# EAGLE design mc_psu_v2 (EAGLE 9.4.2)
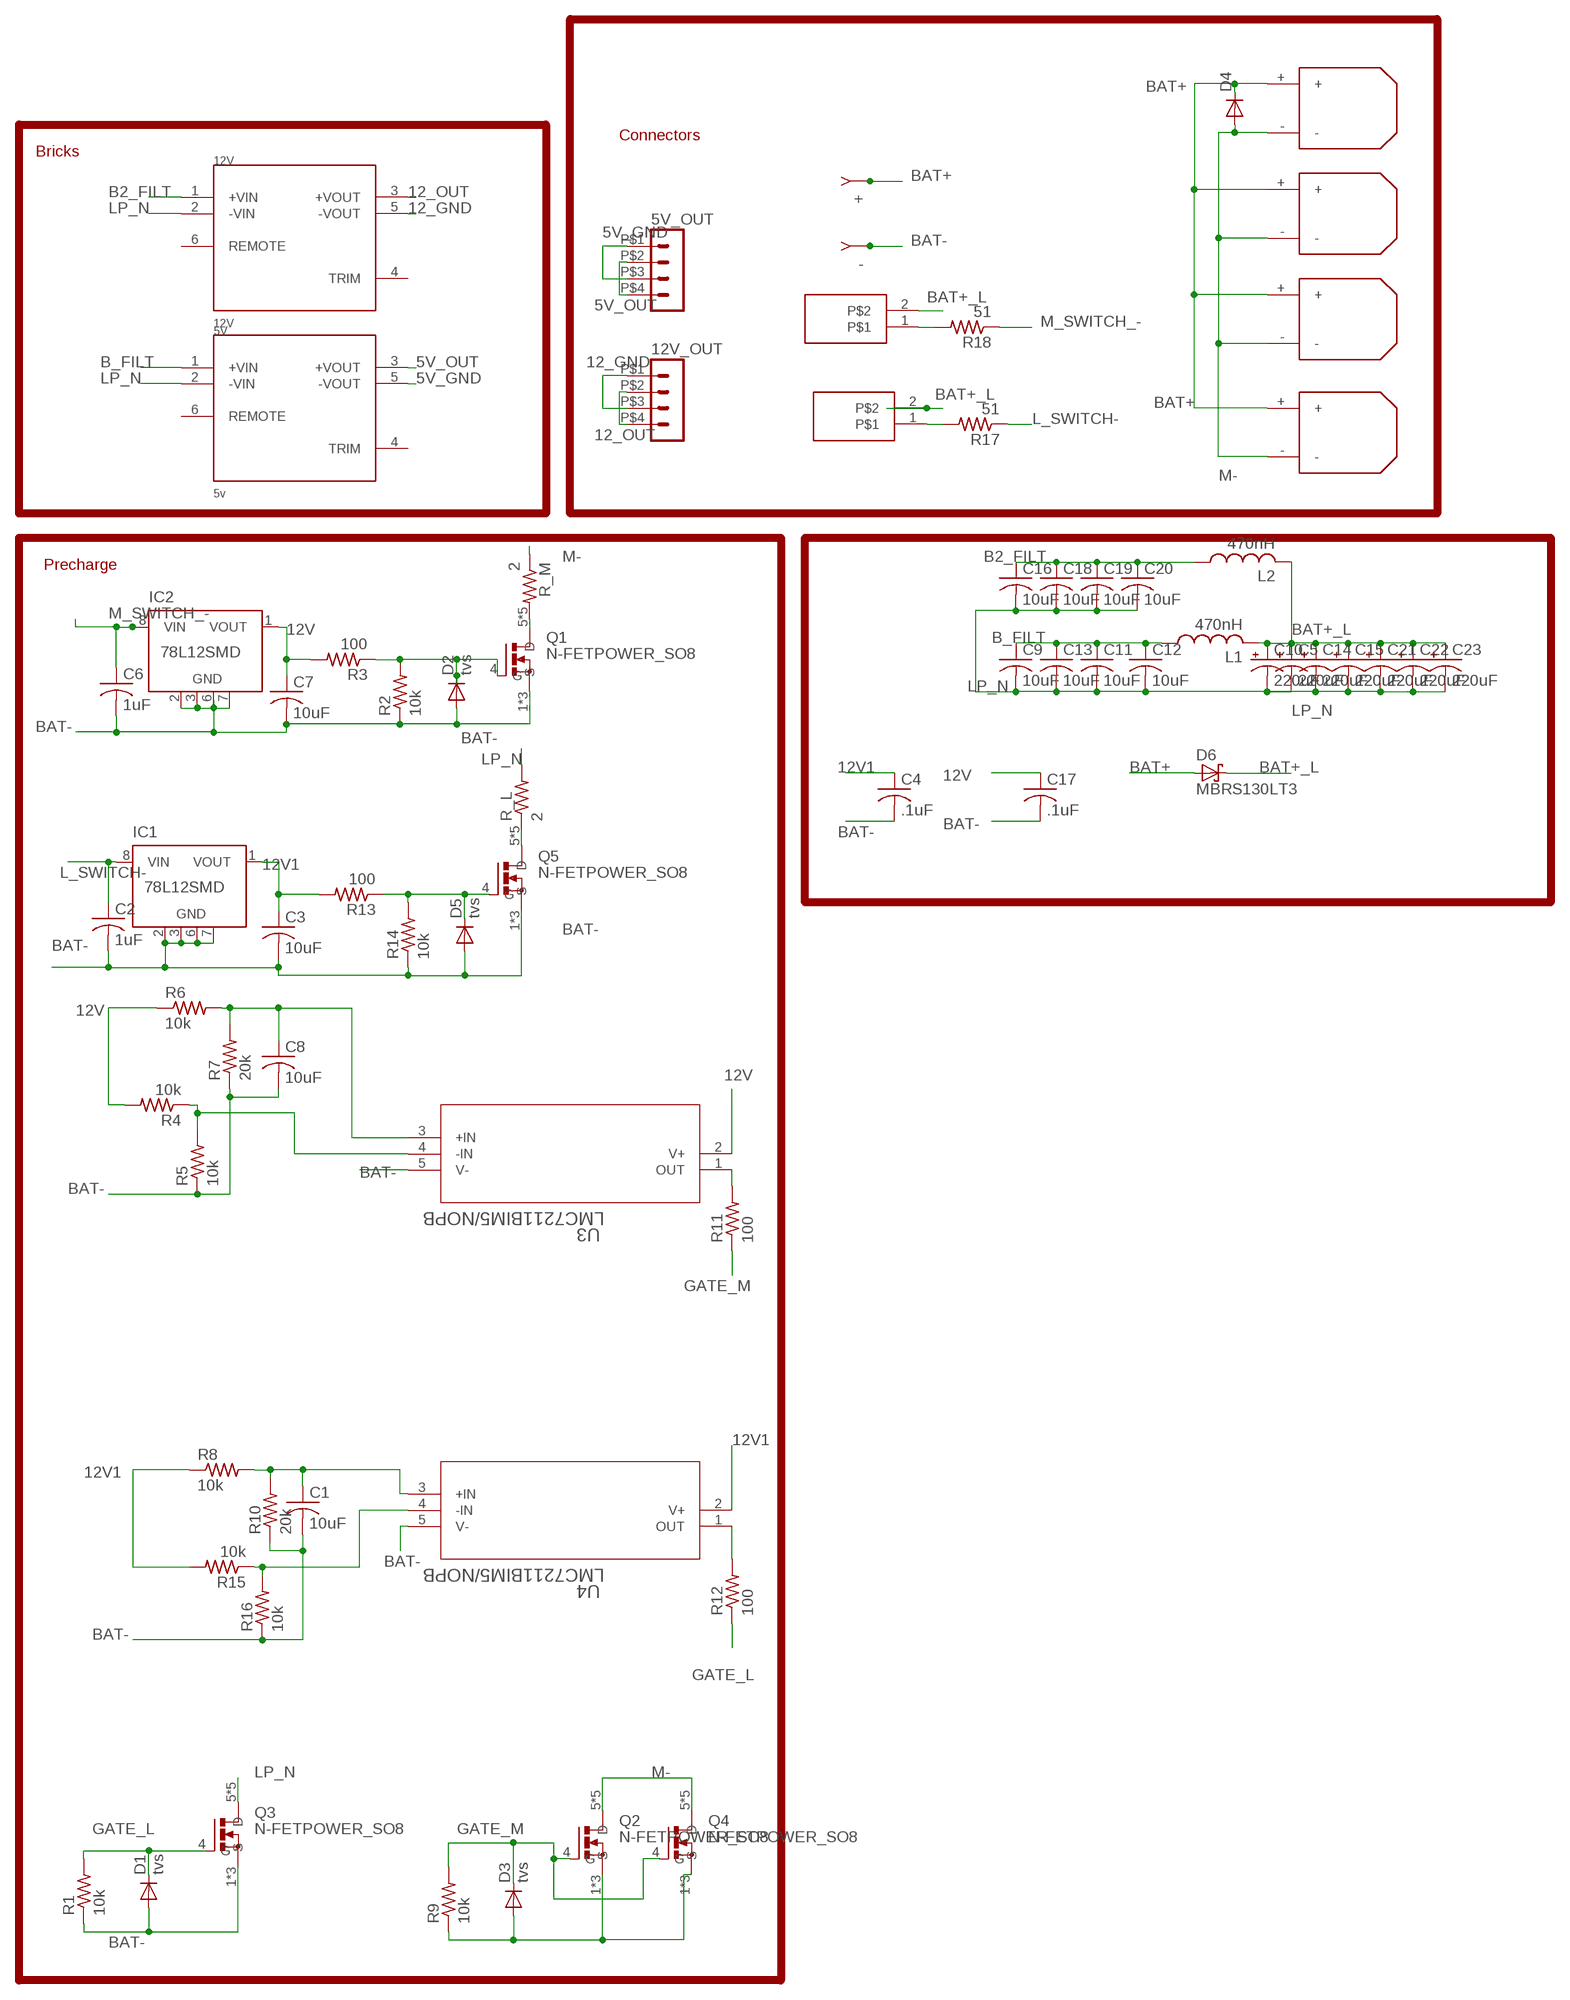
[diagram p0: schematic, sheet 1]

## Parts
5V  5v  PDQ30-Q24-S5-D  [CONV_PDQ30-Q24-S5-D]
5V_OUT  HEADER_POS4_43045-0401  [43045-0400]
12V  12V  PDQ30-Q24-S5-D  [CONV_PDQ30-Q24-S5-D]
12V_OUT  HEADER_POS4_43045-0401  [43045-0400]
+  QFIT  [FASTON]
-  QFIT  [FASTON]
C1  10uF  C-USC0603K  [C0603K]
C2  1uF  C-USC0603K  [C0603K]
C3  10uF  C-USC0603K  [C0603K]
C4  .1uF  C-USC0603K  [C0603K]
C5  220uF  CPOL-USE3.5-8  [E3,5-8]
C6  1uF  C-USC0603K  [C0603K]
C7  10uF  C-USC0603K  [C0603K]
C8  10uF  C-USC0603K  [C0603K]
C9  10uF  C-USC1206K  [C1206K]
C10  220uF  CPOL-USE3.5-8  [E3,5-8]
C11  10uF  C-USC1206K  [C1206K]
C12  10uF  C-USC1206K  [C1206K]
C13  10uF  C-USC1206K  [C1206K]
C14  220uF  CPOL-USE3.5-8  [E3,5-8]
C15  220uF  CPOL-USE3.5-8  [E3,5-8]
C16  10uF  C-USC1206K  [C1206K]
C17  .1uF  C-USC0603K  [C0603K]
C18  10uF  C-USC1206K  [C1206K]
C19  10uF  C-USC1206K  [C1206K]
C20  10uF  C-USC1206K  [C1206K]
C21  220uF  CPOL-USE3.5-8  [E3,5-8]
C22  220uF  CPOL-USE3.5-8  [E3,5-8]
C23  220uF  CPOL-USE3.5-8  [E3,5-8]
D1  tvs  DIODE-DO214AC  [DO214AC]
D2  tvs  DIODE-DO214AC  [DO214AC]
D3  tvs  DIODE-DO214AC  [DO214AC]
D4  DIODE-SMB  [SMB]
D5  tvs  DIODE-DO214AC  [DO214AC]
D6  MBRS130LT3  [SMB]
IC1  78L12SMD  [SO08]
IC2  78L12SMD  [SO08]
L1  470nH  L-USL3225P  [L3225P]
L2  470nH  L-USL3225P  [L3225P]
Q1  N-FETPOWER_SO8  [TRANS_TPH5900CNH,L1Q]
Q2  N-FETPOWER_SO8  [TRANS_TPH5900CNH,L1Q]
Q3  N-FETPOWER_SO8  [TRANS_TPH5900CNH,L1Q]
Q4  N-FETPOWER_SO8  [TRANS_TPH5900CNH,L1Q]
Q5  N-FETPOWER_SO8  [TRANS_TPH5900CNH,L1Q]
R1  10k  R-US_R0402  [R0402]
R2  10k  R-US_R0402  [R0402]
R3  100  R-US_R0402  [R0402]
R4  10k  R-US_R0402  [R0402]
R5  10k  R-US_R0402  [R0402]
R6  10k  R-US_R0402  [R0402]
R7  20k  R-US_R0402  [R0402]
R8  10k  R-US_R0402  [R0402]
R9  10k  R-US_R0402  [R0402]
R10  20k  R-US_R0402  [R0402]
R11  100  R-US_R0402  [R0402]
R12  100  R-US_R0402  [R0402]
R13  100  R-US_R0402  [R0402]
R14  10k  R-US_R0402  [R0402]
R15  10k  R-US_R0402  [R0402]
R16  10k  R-US_R0402  [R0402]
R17  51  R-US_R0603  [R0603]
R18  51  R-US_R0603  [R0603]
R_L  2  RESISTOR  [D2PAK]
R_M  2  RESISTOR  [D2PAK]
U3  LMC7211BIM5/NOPB  [MF05A]
U4  LMC7211BIM5/NOPB  [MF05A]
U$3  XT30FEMALW  [XT30_H_F]
U$8  XT30FEMALW  [XT30_H_F]
U$9  XT30FEMALW  [XT30_H_F]
U$10  XT30FEMALW  [XT30_H_F]
U$13  2-PINM80_H  [M80-840242]
U$14  2-PINM80_H  [M80-840242]

## Nets
5V_GND: 5V.5(-VOUT) 5V_OUT.P$1 5V_OUT.P$3
5V_OUT: 5V.3(+VOUT) 5V_OUT.P$2 5V_OUT.P$4
12_GND: 12V.5(-VOUT) 12V_OUT.P$1 12V_OUT.P$3
12_OUT: 12V.3(+VOUT) 12V_OUT.P$2 12V_OUT.P$4
12V: C7.1 C17.1 IC2.1(VOUT) R3.2 R4.2 R6.1 U3.2(V+)
12V1: C3.1 C4.1 IC1.1(VOUT) R8.1 R13.2 R15.2 U4.2(V+)
B2_FILT: 12V.1(+VIN) C16.1 C18.1 C19.1 C20.1 L2.1
B_FILT: 5V.1(+VIN) C9.1 C11.1 C12.1 C13.1 L1.1
BAT+: +.1 +.2 D4.C D6.A U$3.+ U$8.+ U$9.+ U$10.+
BAT+_L: C5.+ C10.+ C14.+ C15.+ C21.+ C22.+ C23.+ D6.C L1.2 L2.2 U$13.2 U$14.2
BAT-: -.1 -.2 C1.2 C2.2 C3.2 C4.2 C6.2 C7.2 C8.2 C17.2 D1.A D2.A D3.A D5.A IC1.2(GND) IC1.3(GND) IC1.6(GND) IC1.7(GND) IC2.2(GND) IC2.3(GND) IC2.6(GND) IC2.7(GND) Q1.1(S) Q1.2(S) Q1.3(S) Q2.1(S) Q2.2(S) Q2.3(S) Q3.1(S) Q3.2(S) Q3.3(S) Q4.1(S) Q4.2(S) Q4.3(S) Q5.1(S) Q5.2(S) Q5.3(S) R1.1 R2.1 R5.1 R7.1 R9.1 R10.1 R14.1 R16.1 U3.5(V-) U4.5(V-)
GATE_L: D1.C Q3.4(G) R1.2 R12.1
GATE_M: D3.C Q2.4(G) Q4.4(G) R9.2 R11.1
L_SWITCH-: C2.1 IC1.8(VIN) R17.1
LP_N: 5V.2(-VIN) 12V.2(-VIN) C5.- C9.2 C10.- C11.2 C12.2 C13.2 C14.- C15.- C16.2 C18.2 C19.2 C20.2 C21.- C22.- C23.- Q3.5(D) Q3.6(D) Q3.7(D) Q3.8(D) Q3.EP(D) R_L.3
M-: D4.A Q2.5(D) Q2.6(D) Q2.7(D) Q2.8(D) Q2.EP(D) Q4.5(D) Q4.6(D) Q4.7(D) Q4.8(D) Q4.EP(D) R_M.1 U$3.- U$8.- U$9.- U$10.-
M_SWITCH_-: C6.1 IC2.8(VIN) R18.1
N$1: Q1.5(D) Q1.6(D) Q1.7(D) Q1.8(D) Q1.EP(D) R_M.3
N$2: D5.C Q5.4(G) R13.1 R14.2
N$3: D2.C Q1.4(G) R2.2 R3.1
N$4: R12.2 U4.1(OUT)
N$5: R18.2 U$13.1
N$6: C1.1 R8.2 R10.2 U4.3(+IN)
N$7: C8.1 R6.2 R7.2 U3.3(+IN)
N$8: R17.2 U$14.1
N$9: R11.2 U3.1(OUT)
N$10: R4.1 R5.2 U3.4(-IN)
N$13: Q5.5(D) Q5.6(D) Q5.7(D) Q5.8(D) Q5.EP(D) R_L.1
N$15: R15.1 R16.2 U4.4(-IN)
Unconnected: 5V.4(TRIM) 5V.6(REMOTE) 12V.4(TRIM) 12V.6(REMOTE) IC1.4(NC) IC1.5(NC) IC2.4(NC) IC2.5(NC)

## Notes on the sheet
- Connectors
- Bricks
- Precharge

## Library data of the parts
5V 12V = PDQ30-Q24-S5-D:PDQ30-Q24-S5-D: 12 Vdc, 2.5 A, 30 W, 9 ~ 36 Vdc; CUI_PURCHASE_URL: https://www.cui.com/product/power/dc-dc-converters/isolated/pdq30-d-series?utm_source=snapeda.com&utm_medium=referral&utm_campaign=snapedaBOM; DESCRIPTION: PDQ30-D Series 30 W 6 A 24 V Input 5 V Output Isolated DC-DC Converter; DIGI-KEY_PART_NUMBER: 102-3891-ND; DIGI-KEY_PURCHASE_URL: https://www.digikey.com/product-detail/en/cui-inc/PDQ30-Q24-S5-D/102-3891-ND/6165424?utm_source=snapeda&utm_medium=aggregator&utm_campaign=symbol; MF: CUI; MP: PDQ30-Q24-S5-D; PACKAGE: DIP-6 CUI
5V_OUT 12V_OUT = con-molex-micro-fit-3_0:HEADER_POS4_?: Molex - Micro-Fit 3.0 Series connector, 3.00mm (0.118") pitch header, 4 positions.
+ - = keystone:QFIT: QUICKFIT PCB TERMINAL
C1-C4 C6-C9 C11-C13 C16-C20 = rcl:C-US: CAPACITOR, American symbol
C5 C10 C14 C15 C21-C23 = rcl:CPOL-US: POLARIZED CAPACITOR, American symbol
D1-D5 = diode:DIODE-: DIODE
D6 = diode:MBRS130LT3: Schottky Power Rectifier Source: http://www.onsemi.com/pub/Collateral/MBRS130LT3-D.PDF
IC1 IC2 = linear:78L*SMD: Positive VOLTAGE REGULATOR
L1 L2 = rcl:L-US: INDUCTOR, American symbol
Q1-Q5 = Ben_Library:N-FET: N-CHANNEL MOS FET SYMBOL
R1-R18 = rcl:R-US_: RESISTOR, American symbol
R_L R_M = BenLibrary:RESISTOR
U3 U4 = lmc7211:LMC7211BIM5/NOPB; MANUFACTURER_PART_NUMBER: LMC7211BIM5NOPB; VENDOR: Texas Instruments
U$3 U$8-U$10 = Ben_Library:XT30
U$13 U$14 = Ben_Library:2-PIN

## Board
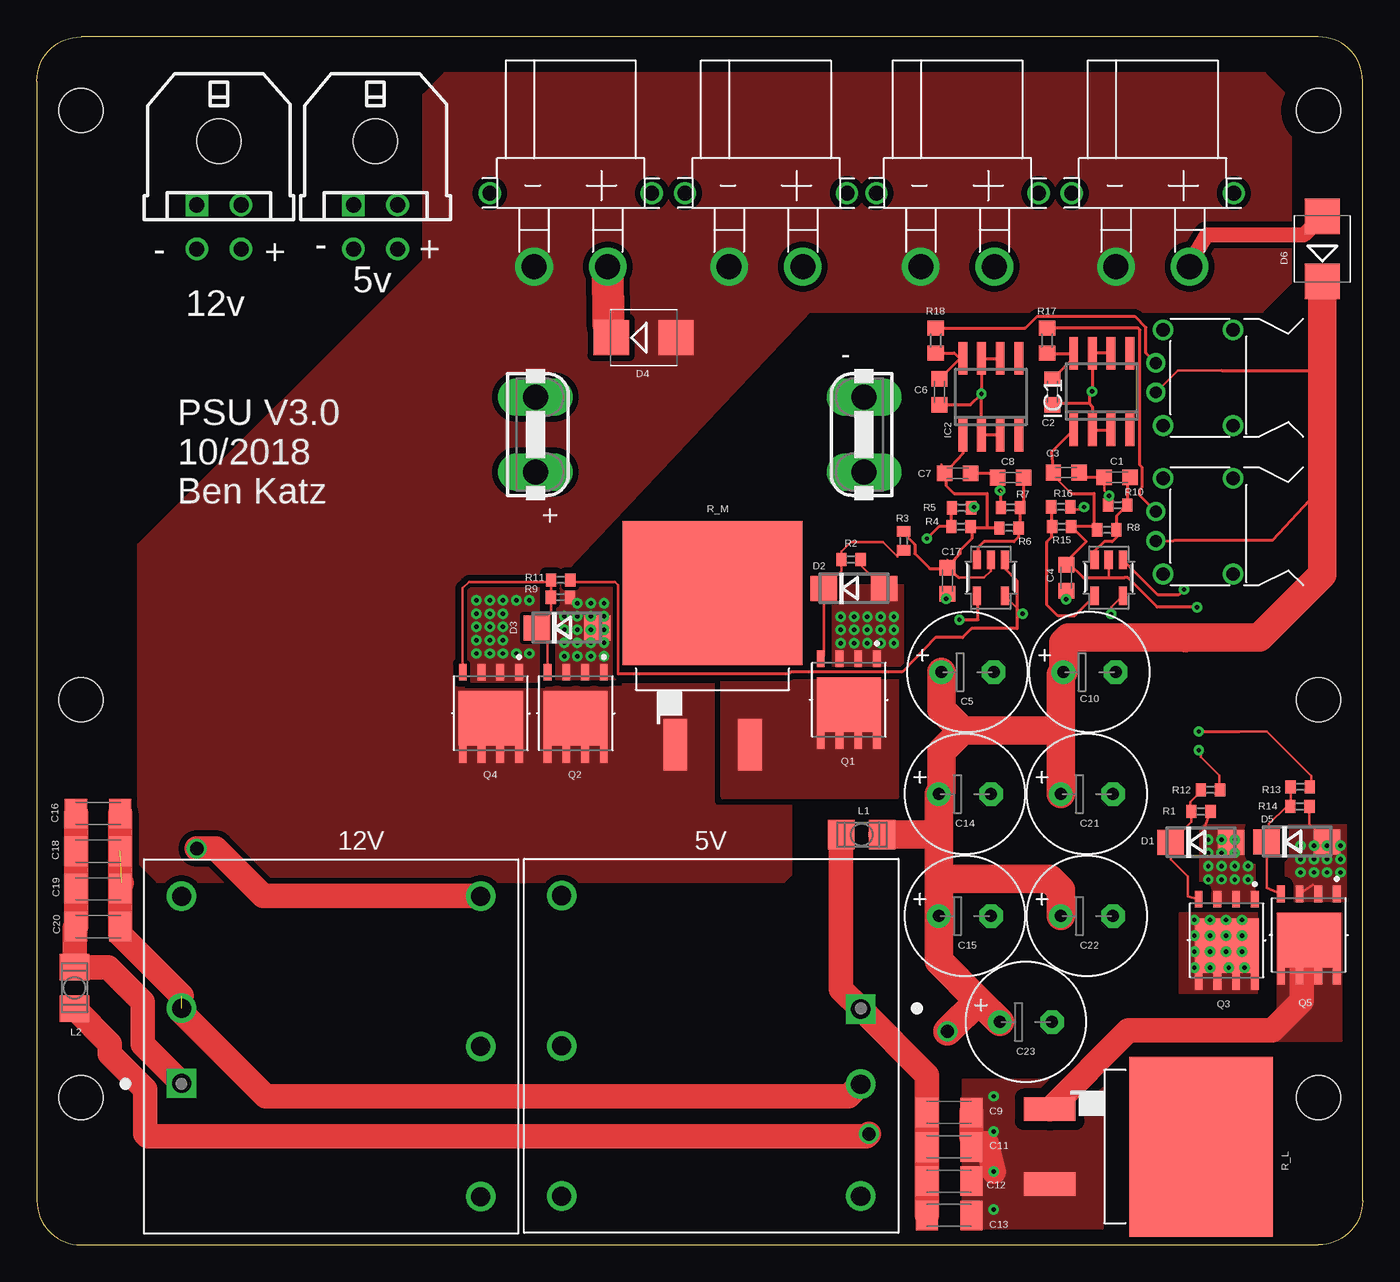
[diagram p1: board, top side]
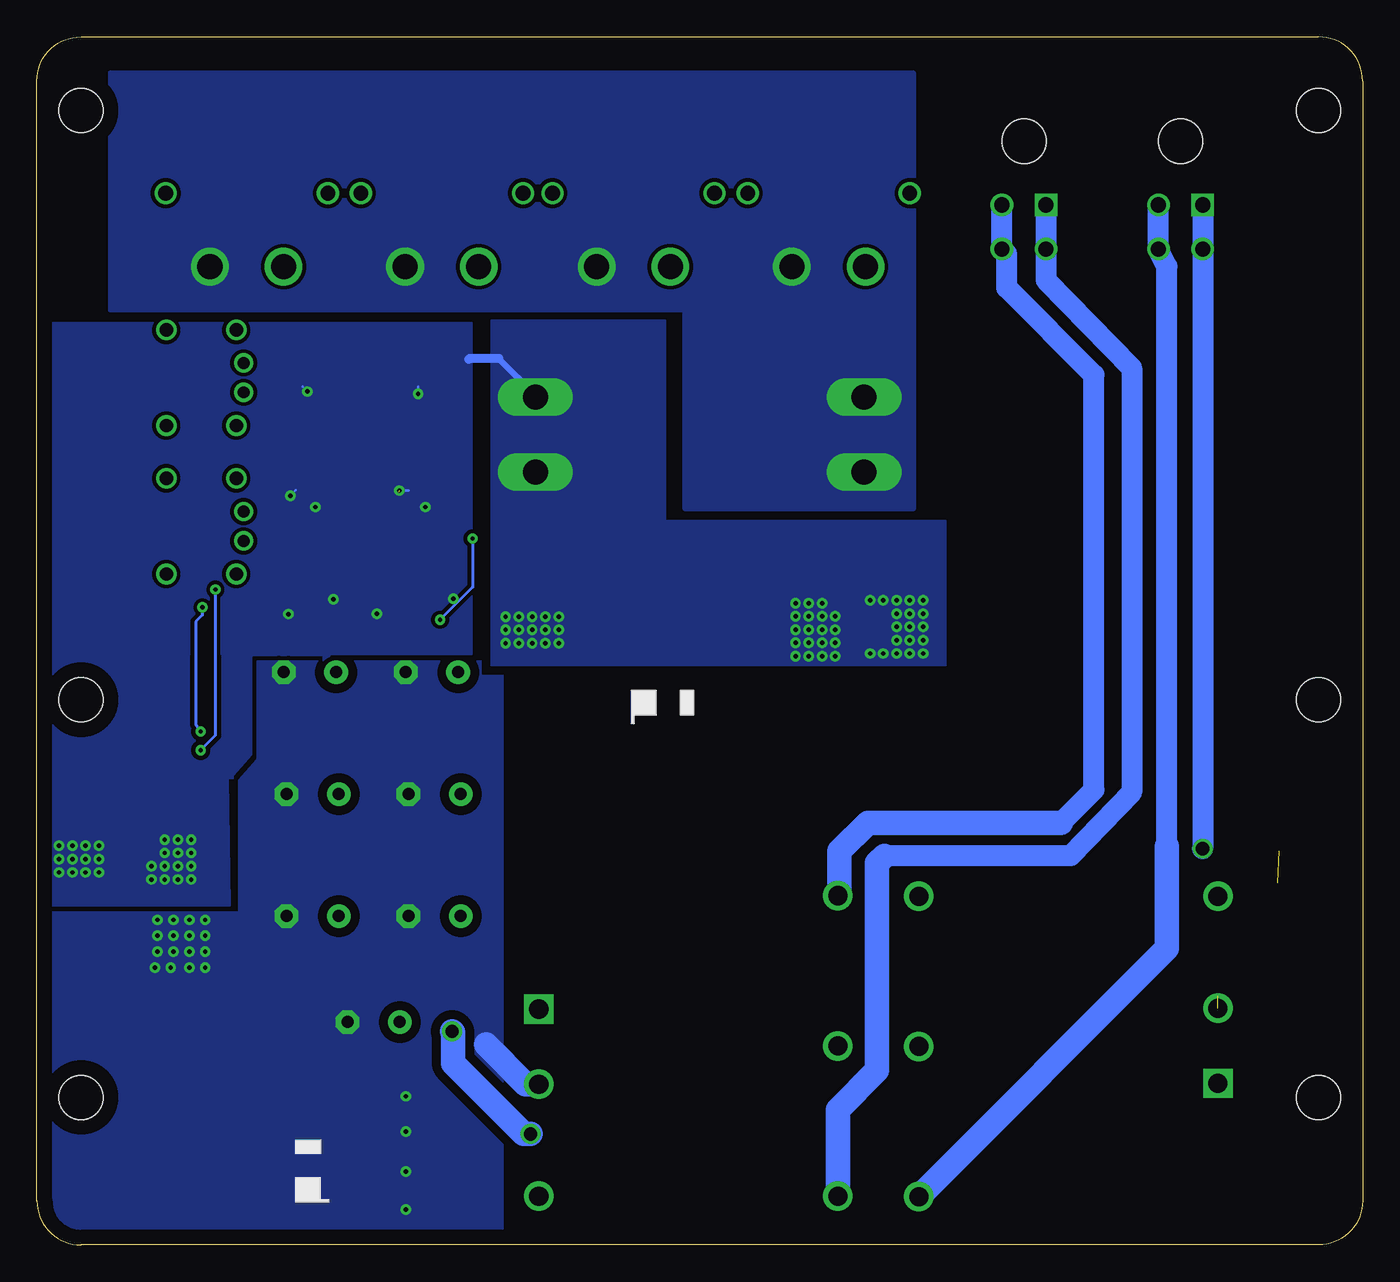
[diagram p2: board, bottom side, seen from below]

Size 90 x 82 mm. Coordinates in mm from the lower left corner, seen from the top.
Outline: 3,0 87,0 arc90 90,3 90,79 arc90 87,82 3,82 arc90 0,79 0,3 arc90 3,0
Copper layers (1*16): Top 0.035mm / dielectric 1.5mm / Bottom 0.035mm
Design rules "default *": minimum track width 8mil, minimum drill 0.3mm, track to track 8mil, track to pad 8mil, pad to pad 8mil, via to via 8mil, smd to smd 8mil, copper to edge 40mil, drill to drill 8mil, minimum pad ring 10mil, minimum via ring 8mil, stop-mask expansion 4mil, vias tented up to drill 0mil, thermal gap 10mil
Holes 3 mm at 3,10 87,10 87,37 3,37 3,77 87,77

### Footprints (pad centres in the part's own frame; a part is rotated, then mirrored left to right if it is on the bottom)
CONV_PDQ30-Q24-S5-D = drill 1.3 pad 2 square: 1 -2.5,10.15 | drill 1.3 pad 2: 2 2.6,10.15; 3 -10.2,-10.15; 4 0,-10.15; 5 10.2,-10.15; 6 10.2,10.15
43045-0400 = drill 1.02 square: P$1 1.5,4.32 | drill 1.02: P$2 -1.5,4.32; P$3 1.5,7.32; P$4 -1.5,7.32 | hole 3: 0,0
FASTON = drill 1.676 pad 2.54 long: 1 -2.54,0; 2 2.54,0
C0603K = smd 1.05 x 1.08: 1 -0.875,0; 2 0.875,0
E3,5-8 = drill 0.813 pad 1.6: + -1.778,0 | drill 0.813 pad 1.6 octagon: - 1.778,0
C1206K = smd 1.5 x 2: 1 -1.5,0; 2 1.5,0
DO214AC = smd 1.8 x 1.7: A 2.05,0; C -2.05,0
SMB = smd 2.4 x 2.4: A 2.2,0; C -2.2,0
SO08 = smd 0.6 x 2.2: 1 -1.905,-2.6; 2 -0.635,-2.6; 3 0.635,-2.6; 4 1.905,-2.6; 5 1.905,2.6; 6 0.635,2.6; 7 -0.635,2.6; 8 -1.905,2.6
L3225P = smd 1.8 x 2: 1 -1.4,0; 2 1.4,0
TRANS_TPH5900CNH,L1Q = smd 1.13 x 0.53: 1 -2.79,1.905; 2 -2.79,0.635; 3 -2.79,-0.635; 4 -2.79,-1.905 | smd 1.33 x 0.53: 5 2.69,-1.905; 6 2.69,-0.635; 7 2.69,0.635; 8 2.69,1.905 | smd 3.7 x 4.35: EP 0.35,0
R0402 = smd 0.7 x 0.9: 1 -0.65,0; 2 0.65,0
R0603 = smd 1 x 1.1: 1 -0.85,0; 2 0.85,0
D2PAK = smd 1.6 x 3.5: 1 -2.54,-10.28; 3 2.54,-10.28 | smd 12.2 x 9.75: 2 0,0
MF05A = smd 1.27 x 0.559: 1 -1.219,0.953; 2 -1.219,0; 3 -1.219,-0.953; 4 1.219,-0.953; 5 1.219,0.953
XT30_H_F = drill 1.7: + 2.5,0.15; - -2.5,0.15 | drill 1: P$3 5.5,5.135; P$4 -5.5,5.135
M80-840242 = drill 0.8: 1 1,0; 2 -1,0 | drill 0.9: P$4 3.25,-0.5; P$5 -3.25,-0.5; P$6 -3.25,-5.25; P$7 3.25,-5.25

### Placement (x,y rotation side)
5V  45.78,13.5 270 top
5V_OUT  22.99,74.91 180 top
12V  19.98,13.46 90 top
12V_OUT  12.36,74.91 180 top
+  33.85,55 90 top
-  56.15,55 270 top
C1  73.33,52.1 180 top
C2  68.94,57.89 270 top
C3  69.88,52.42 0 top
C4  69.88,45.28 270 top
C5  63.18,38.88 0 top
C6  61.27,57.9 270 top
C7  62.5,52.37 0 top
C8  66.11,52.08 180 top
C9  61.93,8.98 0 top
C10  71.46,38.88 0 top
C11  61.93,6.64 0 top
C12  61.93,4.32 0 top
C13  61.93,2 0 top
C14  63,30.6 0 top
C15  63,22.32 0 top
C16  4.16,29.28 0 top
C17  61.81,45.07 270 top
C18  4.16,26.72 0 top
C19  4.16,24.16 0 top
C20  4.16,21.6 0 top
C21  71.28,30.6 0 top
C22  71.28,22.32 0 top
C23  67.14,15.12 0 top
D1  79.02,27.31 0 top
D2  55.47,44.54 0 top
D3  35.98,41.88 0 top
D4  41.19,61.58 0 top
D5  85.54,27.36 0 top
D6  87.26,67.6 90 top
IC1  72.28,57.92 0 top
IC2  64.76,57.56 0 top
L1  56,27.84 0 top
L2  2.56,17.44 270 top
Q1  55.12,37 270 top
Q2  36.58,36.08 270 top
Q3  80.77,20.67 270 top
Q4  30.82,36.08 270 top
Q5  86.34,21.03 270 top
R1  79.02,29.42 180 top
R2  55.27,46.52 180 top
R3  58.84,47.79 90 top
R4  62.73,48.75 0 top
R5  62.77,50.03 180 top
R6  65.99,48.66 0 top
R7  66.09,50.05 0 top
R8  72.63,48.53 0 top
R9  35.54,43.96 180 top
R10  73.37,50.21 0 top
R11  35.56,45.13 0 top
R12  79.66,30.88 0 top
R13  85.76,31.08 0 top
R14  85.73,29.76 180 top
R15  69.56,48.75 0 top
R16  69.51,50.09 180 top
R17  68.58,61.38 90 top
R18  61.02,61.38 90 top
R_L  79.03,6.66 270 top
R_M  45.87,44.24 0 top
U3  64.76,45.28 270 top
U4  72.76,45.28 270 top
U$3  75.75,66.25 0 top
U$8  62.5,66.25 0 top
U$9  49.5,66.25 0 top
U$10  36.25,66.25 0 top
U$13  75.96,58.86 90 top
U$14  75.96,48.78 90 top

### Tracks (layer width: path | path; a pad name or v marks a point on that pad's centre or on a via)
5V_GND
  Bottom 1.422: 5V_OUT.P$1 5V_OUT.P$3 21.49,65.49 15.68,59.52 15.68,30.72 19.84,26.4 32.47,26.4
  Bottom 1.676: 5V.5 35.63,9.17 32.96,11.84 32.96,25.91 32.47,26.4
5V_OUT
  Bottom 1.422: 20.48,28.64 18.24,30.88 18.24,59.04 24.16,64.96 24.16,67.26 5V_OUT.P$4 5V_OUT.P$2
  Bottom 1.676: 20.48,28.64 33.6,28.64 35.52,26.72 35.52,23.81 5V.3
12_GND  (via drill 0.9)
  Top 1.676: v10.86,26.89 12.15,26.89 15.36,23.68 30.11,23.68 12V.5
  Bottom 1.422: 12V_OUT.P$1 12V_OUT.P$3 v10.86,26.89
12_OUT
  Bottom 1.422: 13.28,27.04 13.28,66.41 12V_OUT.P$4 12V_OUT.P$2
  Bottom 1.676: 13.28,27.04 13.28,20.11 12V.3
12V
  Top 0.16: IC2.1 62.85,54.41 | 61.4,52.96 61.4,52.16 61.72,51.84 61.72,52.15 C7.1 | 63.43,48.8 R4.2 | C17.1 61.81,46.49 | 63.48,48.65 63.47,48.66
  Top 0.18: U3.2 64.76,45.75 64.3,45.29 62.59,45.29
  Top 0.204: 62.85,54.41 62.85,53.73 C7.1 | R6.1 64.5,48.66 | 64.5,48.66 63.47,48.66 | 63.47,48.66 R4.2 | 61.72,51.84 61.72,51.54 62.26,51 64.5,51 64.5,48.66 | 63.47,48.66 63.47,47.93 62.66,47.12 62.66,46.92 C17.1 | 62.59,45.29 C17.1 | R3.2 58.7,48.44 59.6,47.53 59.6,46.92 60.62,45.9 61.64,45.9 C17.1
12V1  (via drill 0.3)
  Top 0.16: 70.25,48.71 R15.2 | C3.1 68.88,52.36
  Top 0.18: U4.2 72.76,45.39 72.66,45.29 | 68.88,52.36 70.24,51 | 81.65,34.84 83.48,34.84 86.5,31.82 86.5,31.17 R13.2
  Top 0.203: v78.76,43.28 76.06,43.28 74.05,45.29 73.82,45.29
  Top 0.204: IC1.1 68.88,53.83 C3.1 | R8.1 71.76,48.75 | 71.76,48.75 R15.2 71.23,47.73 69.88,46.38 C4.1 70.04,46.28 71.03,45.29 72.66,45.29 73.82,45.29 | 70.24,51 71.76,51 71.76,48.75 | v78.88,34.84 81.65,34.84
  Bottom 0.204: v78.76,43.28 78.76,42.74 79.2,42.3 79.2,35.34 v78.88,34.84
B2_FILT
  Top 1.676: C16.1 C18.1 C19.1 C20.1 2.56,21.5 L2.1 4.84,18.84 7.2,16.48 7.2,13.59 12V.1
B_FILT
  Top 1.676: L1.1 54.6,17.33 5V.1 60.43,11.5 C9.1 C11.1 C12.1 C13.1
BAT+
  Top 1.016: D6.A 86,68.54 79.4,68.54 78.25,66.63 U$3.+
  Top 2.184: U$10.+ 38.79,62.5 D4.C
  pour Bottom (isolate 0.254, rank 2, no thermals): 30.5,79.5 85,79.5 85,63.5 46,63.5 46,50 30.5,50
BAT+_L  (via drill 0.9)
  Top 0.16: 80.43,59.36 77.46,59.36 U$13.2 | 77.21,47.83 77.16,47.78 U$14.2
  Top 0.204: 87.36,51.61 87.37,51.62 87.37,51.73 87.26,51.84 | 80.43,59.36 87.04,59.36 87.26,59.58 | 77.21,47.83 83.89,47.83 87.26,51.48
  Top 1.422: D6.C 87.12,65.04 87.04,64.96
  Top 1.676: v56.48,7.52 56.32,7.36 7.52,7.36 7.36,7.52 7.36,10.56 4.96,12.96 4.96,13.64 L2.2
  Top 1.93: D6.C 87.26,59.58 87.26,51.84 87.26,51.48 87.26,45.5 82.98,41.22 77.94,41.22 | 77.94,41.22 70.02,41.22 69.68,40.88 C10.+ 69.5,38.7 69.5,35.1 | 61.22,28.26 C14.+ 61.4,30.78 61.4,33.5 62.82,34.92 | 61.22,28.26 61.22,25.02 | 61.22,25.02 C15.+ 61.22,19.26 63.91,16.57 | 63.91,16.57 C23.+ | v61.81,14.48 61.82,14.48 63.91,16.57 | C22.+ 69.5,24.1 68.76,24.84 61.4,24.84 61.22,25.02 | 77.96,41.2 77.94,41.22 | C21.+ 69.5,35.1 | C5.+ 61.4,36.34 62.82,34.92 | 62.82,34.92 69.32,34.92 69.5,35.1 | L1.2 60.8,27.84 61.22,28.26
  Bottom 1.676: v56.48,7.52 56.96,7.52 61.76,12.32 61.76,14.43 v61.81,14.48
BAT-  (via drill 0.3)  (1 unrouted)
  Top 0.16: C17.2 61.81,43.93 v61.72,43.84 | 65.44,51.09 65.44,52.28 C8.2 | R5.1 63.59,50.03 v63.64,50.08 | IC1.2 | 71.64,56.33 71.64,56.32 | 71.2,52.1 C3.2 | 72.72,51.84 C1.2 72.45,51.19 v72.8,50.84 | R16.1 70.34,49.91 71.25,49.91 v71.08,50.08 | C4.2 v69.88,43.82 | 86.63,24.43 Q5.3
  Top 0.18: U3.5 65.71,44.04 v66.91,42.84 | U4.5 72.94,43.28 v72.94,42.82 | R14.1 86.38,28.56 D5.A | R1.1 79.13,27.89 v79.52,27.5 | R2.1 55.92,46.14 D2.A
  Top 0.204: IC1.6 IC1.7 v71.64,57.92 71.44,57.72 71.44,57.12 | C2.2 69.05,57.12 71.44,57.12 | 71.44,57.12 71.64,56.91 71.64,56.33 IC1.2 IC1.3 | 71.2,52.1 C1.2 | v72.8,50.84 72.72,50.76 R10.1 | IC2.3 IC2.2 v64.12,57.76 | C6.2 63.38,57.02 v64.12,57.76 | IC2.6 IC2.7 v64.12,57.77 v64.12,57.76 | C7.2 64.94,52.37 C8.2 | v65.4,51.2 65.4,50.09 R7.1
  Bottom 0.16: v64.12,57.76 64.12,58.24 | v61.72,43.84 61.72,43.68 | v65.4,51.2 64.76,51.2 | v63.64,50.08 63.96,50.08 | v71.64,57.92 71.96,58.24 | v72.8,50.84 72.8,50.86 72.44,51.22 | v71.08,50.08 71.02,50.08
  Bottom 0.18: v66.91,42.84 66.71,42.84
  Bottom 0.406: 58.64,60.16 56.15,57.67 -.1
  Bottom 0.61: 60.66,60.12 60.62,60.16 58.64,60.16
  other vias: 58.18,40.84 30.74,40.14 29.84,40.14 38.5,39.96 88.49,25.28 82.22,24.8 81.32,24.8 80.42,24.8 79.52,24.8 79.52,25.7 80.42,25.7 81.32,25.7 82.22,25.7 87.59,25.28 86.69,25.28 85.79,25.28 85.79,26.18 86.69,26.18 87.59,26.18 88.49,26.18 88.49,27.08 87.59,27.08 86.69,27.08 85.79,27.08 79.52,26.6 80.42,26.6 81.32,26.6 80.42,27.5 81.32,27.5 31.64,40.14 32.54,40.14 33.44,40.14 29.84,41.04 29.84,41.94 30.74,41.94 30.74,41.04 31.64,41.04 31.64,41.94 31.64,42.84 30.74,42.84 29.84,42.84 29.84,43.74 30.74,43.74 31.64,43.74 32.54,43.74 33.44,43.74 37.6,39.96 36.7,39.96 35.8,39.96 38.5,40.86 37.6,40.86 36.7,40.86 35.8,40.86 35.8,41.76 35.8,42.66 36.7,42.66 36.7,41.76 37.6,41.76 37.6,42.66 38.5,42.66 38.5,41.76 38.5,43.56 37.6,43.56 36.7,43.56 57.28,40.84 56.38,40.84 55.48,40.84 54.58,40.84 54.58,41.74 55.48,41.74 56.38,41.74 57.28,41.74 58.18,41.74 58.18,42.64 57.28,42.64 56.38,42.64 55.48,42.64 54.58,42.64
  pour Bottom (isolate 0.254, rank 2, no thermals): 60.48,62.56 89.28,62.56 88.94,40.1 60.5,40.1
  pour Bottom (isolate 0.254, no thermals): 47.36,62.72 59.12,62.72 59.12,39.36 28.32,39.36 28.32,49.12 47.36,49.12
  pour Top (isolate 0.254, no thermals): 54.04,39.3 54.04,44.74 58.78,44.74 58.78,39.3
  pour Top (isolate 0.254, no thermals): 29.12,38.24 29.12,44.76 34.06,44.76 34.06,38.24
  pour Top (isolate 0.254, no thermals): 39.34,38.4 39.34,44.74 35.28,44.74 35.28,38.4
  pour Bottom (isolate 0.305, rank 3, no thermals): 70.08,42.72 88.96,42.72 88.96,23.04 76.92,23.04 77.04,31.68 70.38,31.68
  pour Top (isolate 0.61, rank 2, no thermals): 78.98,23.2 82.66,23.2 82.66,28.48 78.98,28.48
  pour Top (isolate 0.61, rank 2, no thermals): 88.84,23.36 84.78,23.36 84.78,28.48 88.84,28.48
GATE_L
  Top 0.18: Q3.4 78.12,23.66 78.12,25.02 76.97,26.17 D1.C 77.39,27.73 77.83,28.17 78.37,28.71 R1.2 78.3,29.49 78.3,30.06 79.01,30.77 R12.1
GATE_M
  Top 0.18: Q4.4 28.91,44.58 29.34,45 34.78,45 R11.1 34.91,43.98 R9.2 34.89,42.84 D3.C 34.67,41.13 Q2.4
L_SWITCH-
  Top 0.16: C2.1 68.94,59.09
  Top 0.203: R17.1 68.63,60.48 70.38,60.48
  Top 0.204: IC1.8 70.38,60.48 70.38,60.2 C2.1
LP_N  (via drill 0.3)  (2 unrouted)
  Top 1.676: C16.2 C19.2 | 5.76,24.58 C19.2 | C19.2 C20.2 5.66,21.06 9.83,16.89 | 12V.2 9.83,15.77 15.52,10.08 55.11,10.08 5V.2 | C9.2 63.43,7.29 63.84,6.88 64.48,6.88 v64.96,4.96
  Bottom 1.676: 5V.2 56.82,10.9 59.52,13.6
  other vias: 81.81,22.06 64.96,2.4 64.96,7.68 64.96,10.08 80.73,22.06 79.65,22.06 78.57,22.06 78.57,20.98 79.65,20.98 80.73,20.98 81.81,20.98 81.81,19.9 80.73,19.9 79.65,19.9 78.57,19.9 78.57,18.82 79.65,18.82 80.91,18.82 81.99,18.82
  pour Bottom (isolate 0.61, rank 2, no thermals): 88.96,22.56 76.26,22.56 76.26,31.52 75,32.96 75,39.6 58.38,39.6 58.4,11.68 58.4,0.64 88.96,0.64
  pour Top (isolate 0.61, rank 2, no thermals): 62.88,11.2 72.32,11.2 72.32,1.12 62.88,1.12
  pour Top (isolate 0.254, no thermals): 77.58,22.5 82.8,22.5 82.8,17.1 77.58,17.1
M-
  pour Top (isolate 0.406, rank 2, no thermals): 50.88,38.08 51.2,37.76 51.2,25.12 50.72,24.64 8.16,24.64 6.88,25.92 6.88,47.52 26.24,66.88 26.24,78.08 27.68,79.52 83.36,79.52 85.12,77.76 85.12,65.28 83.2,63.36 52.48,63.36 35.58,45.38 28.74,45.28 28.56,38
M_SWITCH_-
  Top 0.16: IC2.8 62.66,60.16
  Top 0.203: R18.1 62.28,60.53 62.66,60.16
  Top 0.204: 62.66,60.16 C6.1
N$1
  pour Top (isolate 0.406, no thermals): 46.62,38.7 58.32,38.7 58.32,30.42 46.62,30.42
N$2
  Top 0.18: Q5.4 83.49,24.23 D5.C 83.64,27.51 83.64,28.56 84.84,29.76 R14.2 85.11,29.79 R13.1
N$3
  Top 0.18: R3.1 58.41,46.71 57.42,47.7 55.26,47.7 54.62,47.06 R2.2 54.62,45.74 D2.C 53.42,39.99 Q1.4
N$4  (via drill 0.3)
  Top 0.18: 78.88,33.3 79.02,33.3 79.02,33.12 80.28,31.86 80.28,30.91 R12.2
  Top 0.203: v77.88,44.48 77.52,44.12 76.09,44.12 U4.1
  Top 0.204: v78.88,33.58 78.88,33.3
  Bottom 0.204: v78.88,33.58 77.88,34.58 v77.88,44.48
N$5
  Top 0.203: U$13.1 75.29,60.53 75.29,62.27 74.52,63.03 67.9,63.03 67.1,62.23 R18.2
N$6
  Top 0.16: 71.8,47.04 U4.3 | 74.2,50.4 R10.2 | 73.3,48.55 R8.2
  Top 0.204: C1.1 74.02,51.91 R10.2 73.28,49.47 R8.2 73.28,48.02 72.99,47.74 72.46,47.74 71.8,47.08 71.8,47.04
N$7
  Top 0.16: R6.2 66.64,48.44 | U3.3
  Top 0.204: C8.1 66.98,50.3 R7.2 66.74,48.76 R6.2 | 66.64,48.44 66.64,48.04 66.34,47.74 64.3,47.74 63.89,47.33 63.89,46.58 U3.3
N$8
  Top 0.203: U$14.1 74.88,50.86 74.88,51.28 75.03,51.43 75.03,52.77 74.88,52.92 74.88,62.1 74.75,62.23 R17.2
N$9
  Top 0.18: 39.46,38.76 39.46,44.78 39.24,45 36.34,45 R11.2
  Top 0.204: U3.1 65.71,45.91 66.54,45.08 66.54,41.82 63.44,41.82 62.83,41.21 61,41.21 58.75,38.9 51.2,38.9 51,38.76 39.46,38.76
N$10  (via drill 0.3)
  Top 0.16: U3.4 63.81,43.69
  Top 0.204: R5.2 62.08,49.99 R4.1 61.23,48.75 v60.42,47.94 | v62.63,42.43 63.89,42.43 63.89,43.98 U3.4
  Bottom 0.204: v60.42,47.94 60.42,44.64 v62.63,42.43
N$13
  Top 1.676: R_L.1 74.11,14.56 83.86,14.56 85.86,16.56 85.86,20.62 Q5.EP
  pour Top (isolate 0.254, no thermals): 84.24,22.5 88.56,22.5 88.56,13.86 84.24,13.86
N$15
  Top 0.16: 68.86,48.8 R15.1 68.71,48.75
  Top 0.204: R16.2 68.91,50.04 R15.1 68.91,48.07 68.58,47.74 68.58,43.43 69.32,42.68 70.43,42.68 U4.4

### Text on the board
tNames: - | + | - | + | 5v | 12v | PSU V3.0 / 10/2018 / Ben Katz